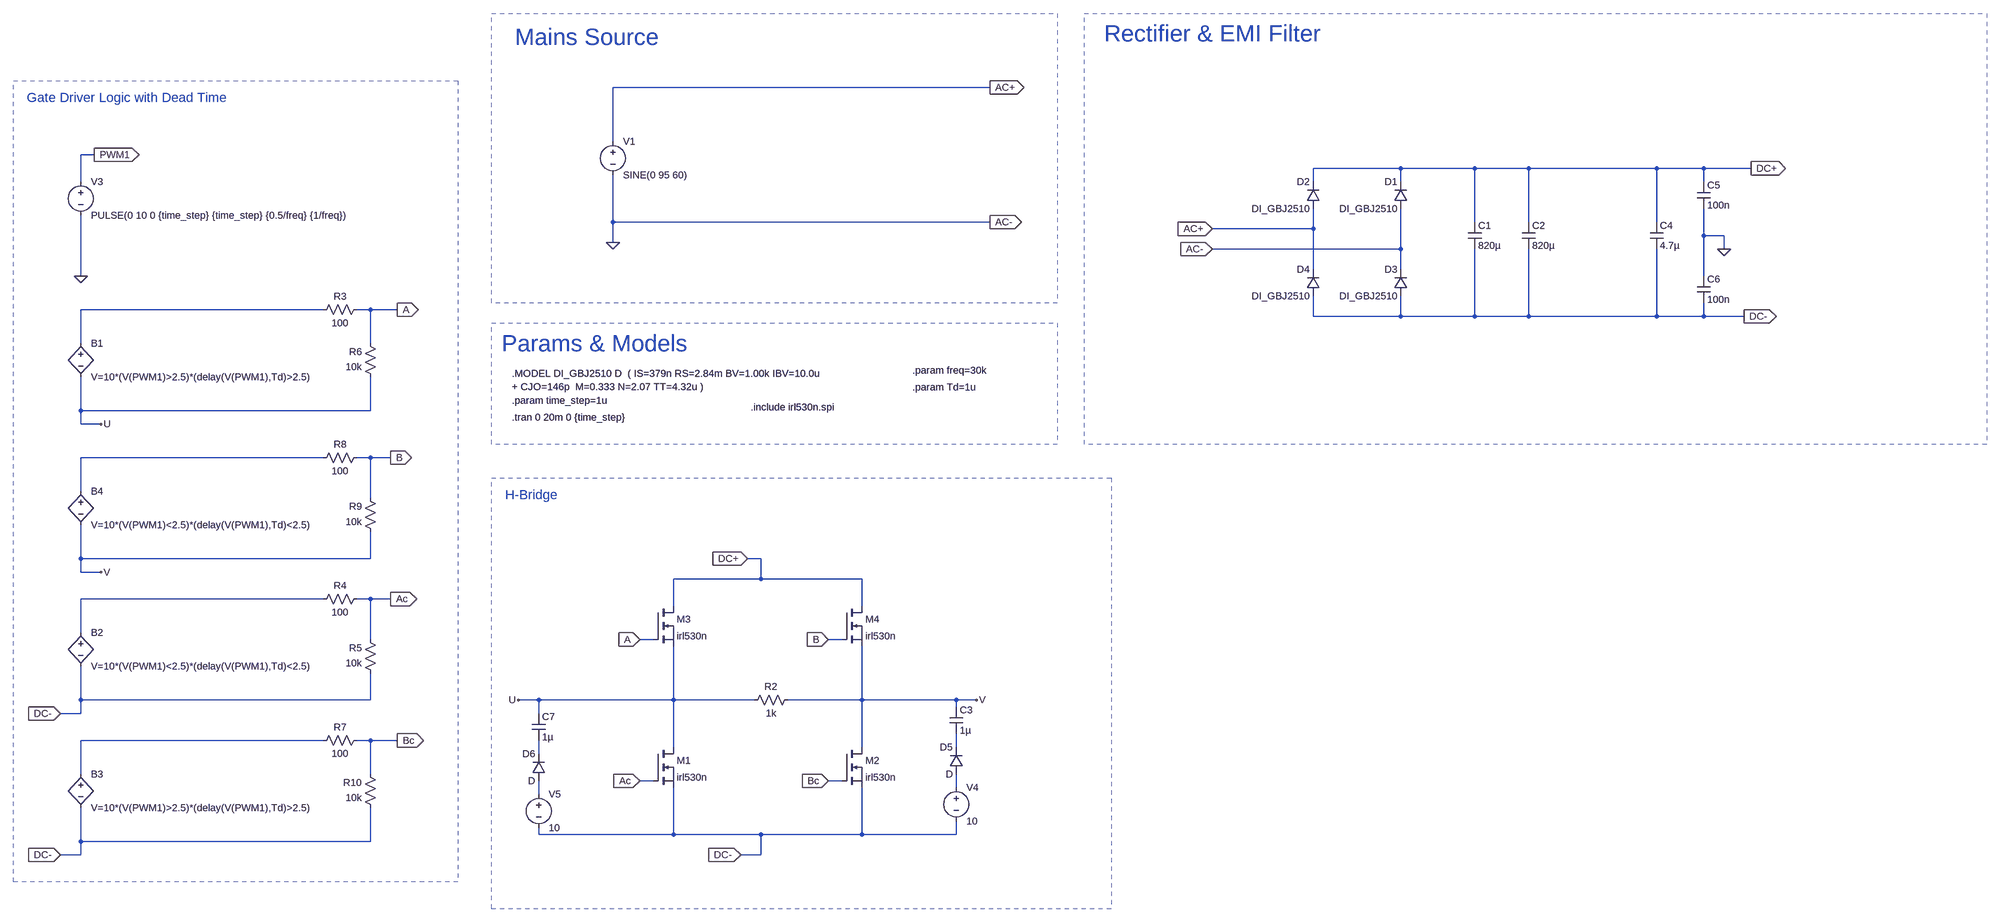
[diagram p0: schematic Rectifier_HBridge.asc]
Rectifier_HBridge.asc, the LTspice schematic file:
Version 4.1
SHEET 1 3640 1044
WIRE 512 -912 -384 -912
WIRE -384 -784 -384 -912
WIRE -1616 -752 -1648 -752
WIRE 1488 -720 1280 -720
WIRE 1664 -720 1488 -720
WIRE 1792 -720 1664 -720
WIRE 2096 -720 1792 -720
WIRE 2208 -720 2096 -720
WIRE 2320 -720 2208 -720
WIRE -1648 -688 -1648 -752
WIRE 1280 -688 1280 -720
WIRE 1488 -688 1488 -720
WIRE 2208 -688 2208 -720
WIRE -384 -592 -384 -704
WIRE 512 -592 -384 -592
WIRE 1664 -592 1664 -720
WIRE 1792 -592 1792 -720
WIRE 2096 -592 2096 -720
WIRE 1280 -576 1280 -624
WIRE 1280 -576 1040 -576
WIRE 2208 -560 2208 -624
WIRE 2256 -560 2208 -560
WIRE -384 -544 -384 -592
WIRE 1488 -528 1488 -624
WIRE 1488 -528 1040 -528
WIRE 2256 -528 2256 -560
WIRE 1280 -480 1280 -576
WIRE 1488 -480 1488 -528
WIRE -1648 -464 -1648 -608
WIRE 2208 -464 2208 -560
WIRE -1072 -384 -1648 -384
WIRE -960 -384 -992 -384
WIRE -896 -384 -960 -384
WIRE 1280 -368 1280 -416
WIRE 1488 -368 1488 -416
WIRE 1488 -368 1280 -368
WIRE 1664 -368 1664 -528
WIRE 1664 -368 1488 -368
WIRE 1792 -368 1792 -528
WIRE 1792 -368 1664 -368
WIRE 2096 -368 2096 -528
WIRE 2096 -368 1792 -368
WIRE 2208 -368 2208 -400
WIRE 2208 -368 2096 -368
WIRE 2304 -368 2208 -368
WIRE -1648 -304 -1648 -384
WIRE -960 -304 -960 -384
WIRE -1648 -144 -1648 -224
WIRE -960 -144 -960 -224
WIRE -960 -144 -1648 -144
WIRE -1648 -112 -1648 -144
WIRE -1600 -112 -1648 -112
WIRE -1072 -32 -1648 -32
WIRE -960 -32 -992 -32
WIRE -912 -32 -960 -32
WIRE -1648 48 -1648 -32
WIRE -960 64 -960 -32
WIRE -1648 208 -1648 128
WIRE -960 208 -960 144
WIRE -960 208 -1648 208
WIRE -32 208 -64 208
WIRE -1648 240 -1648 208
WIRE -1600 240 -1648 240
WIRE -32 256 -32 208
WIRE -32 256 -240 256
WIRE 208 256 -32 256
WIRE -1072 304 -1648 304
WIRE -960 304 -992 304
WIRE -912 304 -960 304
WIRE -240 320 -240 256
WIRE 208 320 208 256
WIRE -1648 384 -1648 304
WIRE -960 400 -960 304
WIRE -288 400 -320 400
WIRE 160 400 128 400
WIRE -1648 544 -1648 464
WIRE -960 544 -960 480
WIRE -960 544 -1648 544
WIRE -560 544 -608 544
WIRE -240 544 -240 416
WIRE -240 544 -560 544
WIRE -48 544 -240 544
WIRE 208 544 208 416
WIRE 208 544 32 544
WIRE 432 544 208 544
WIRE 480 544 432 544
WIRE 432 560 432 544
WIRE -1648 576 -1648 544
WIRE -1648 576 -1696 576
WIRE -560 576 -560 544
WIRE -1072 640 -1648 640
WIRE -960 640 -992 640
WIRE -896 640 -960 640
WIRE -240 656 -240 544
WIRE 208 656 208 544
WIRE 432 656 432 624
WIRE -560 672 -560 640
WIRE -1648 720 -1648 640
WIRE -960 720 -960 640
WIRE -288 736 -320 736
WIRE 160 736 128 736
WIRE 432 752 432 720
WIRE -560 768 -560 736
WIRE -560 864 -560 848
WIRE -240 864 -240 752
WIRE -240 864 -560 864
WIRE -32 864 -240 864
WIRE 208 864 208 752
WIRE 208 864 -32 864
WIRE 432 864 432 832
WIRE 432 864 208 864
WIRE -1648 880 -1648 800
WIRE -960 880 -960 800
WIRE -960 880 -1648 880
WIRE -1648 912 -1648 880
WIRE -1648 912 -1696 912
WIRE -32 912 -32 864
WIRE -32 912 -80 912
FLAG 1040 -576 AC+
IOPIN 1040 -576 In
FLAG 1040 -528 AC-
IOPIN 1040 -528 In
FLAG 512 -912 AC+
IOPIN 512 -912 Out
FLAG 512 -592 AC-
IOPIN 512 -592 Out
FLAG -384 -544 0
FLAG 2256 -528 0
FLAG -320 400 A
IOPIN -320 400 In
FLAG -320 736 Ac
IOPIN -320 736 In
FLAG 128 400 B
IOPIN 128 400 In
FLAG 128 736 Bc
IOPIN 128 736 In
FLAG -1648 -464 0
FLAG -1616 -752 PWM1
IOPIN -1616 -752 Out
FLAG -896 -384 A
IOPIN -896 -384 Out
FLAG -912 304 Ac
IOPIN -912 304 Out
FLAG -896 640 Bc
IOPIN -896 640 Out
FLAG -912 -32 B
IOPIN -912 -32 Out
FLAG -608 544 U
FLAG 480 544 V
FLAG -1600 -112 U
FLAG -1600 240 V
FLAG 2320 -720 DC+
IOPIN 2320 -720 Out
FLAG 2304 -368 DC-
IOPIN 2304 -368 Out
FLAG -64 208 DC+
IOPIN -64 208 In
FLAG -80 912 DC-
IOPIN -80 912 In
FLAG -1696 912 DC-
IOPIN -1696 912 In
FLAG -1696 576 DC-
IOPIN -1696 576 In
SYMBOL voltage -384 -800 R0
WINDOW 123 0 0 Left 0
WINDOW 39 0 0 Left 0
SYMATTR InstName V1
SYMATTR Value SINE(0 95 60)
SYMBOL cap 1648 -592 R0
SYMATTR InstName C1
SYMATTR Value 820µ
SYMBOL cap 1776 -592 R0
SYMATTR InstName C2
SYMATTR Value 820µ
SYMBOL cap 2080 -592 R0
SYMATTR InstName C4
SYMATTR Value 4.7µ
SYMBOL cap 2192 -688 R0
SYMATTR InstName C5
SYMATTR Value 100n
SYMBOL cap 2192 -464 R0
SYMATTR InstName C6
SYMATTR Value 100n
SYMBOL diode 1504 -624 R180
WINDOW 0 24 64 Left 2
WINDOW 3 24 0 Left 2
SYMATTR InstName D1
SYMATTR Value DI_GBJ2510
SYMBOL diode 1296 -624 R180
WINDOW 0 24 64 Left 2
WINDOW 3 24 0 Left 2
SYMATTR InstName D2
SYMATTR Value DI_GBJ2510
SYMBOL diode 1504 -416 R180
WINDOW 0 24 64 Left 2
WINDOW 3 24 0 Left 2
SYMATTR InstName D3
SYMATTR Value DI_GBJ2510
SYMBOL diode 1296 -416 R180
WINDOW 0 24 64 Left 2
WINDOW 3 24 0 Left 2
SYMATTR InstName D4
SYMATTR Value DI_GBJ2510
SYMBOL nmos -288 656 R0
SYMATTR InstName M1
SYMATTR Value irl530n
SYMATTR Prefix X
SYMBOL res 48 528 R90
WINDOW 0 0 56 VBottom 2
WINDOW 3 32 56 VTop 2
SYMATTR InstName R2
SYMATTR Value 1k
SYMBOL nmos 160 656 R0
SYMATTR InstName M2
SYMATTR Value irl530n
SYMATTR Prefix X
SYMBOL nmos -288 320 R0
SYMATTR InstName M3
SYMATTR Value irl530n
SYMATTR Prefix X
SYMBOL nmos 160 320 R0
SYMATTR InstName M4
SYMATTR Value irl530n
SYMATTR Prefix X
SYMBOL voltage -1648 -704 R0
WINDOW 123 0 0 Left 0
WINDOW 39 0 0 Left 0
SYMATTR InstName V3
SYMATTR Value PULSE(0 10 0 {time_step} {time_step} {0.5/freq} {1/freq})
SYMBOL bv -1648 -320 R0
SYMATTR InstName B1
SYMATTR Value V=10*(V(PWM1)>2.5)*(delay(V(PWM1),Td)>2.5)
SYMBOL bv -1648 368 R0
SYMATTR InstName B2
SYMATTR Value V=10*(V(PWM1)<2.5)*(delay(V(PWM1),Td)<2.5)
SYMBOL res -976 -400 R90
WINDOW 0 0 56 VBottom 2
WINDOW 3 32 56 VTop 2
SYMATTR InstName R3
SYMATTR Value 100
SYMBOL res -976 288 R90
WINDOW 0 0 56 VBottom 2
WINDOW 3 32 56 VTop 2
SYMATTR InstName R4
SYMATTR Value 100
SYMBOL res -944 496 R180
WINDOW 0 36 76 Left 2
WINDOW 3 36 40 Left 2
SYMATTR InstName R5
SYMATTR Value 10k
SYMBOL res -944 -208 R180
WINDOW 0 36 76 Left 2
WINDOW 3 36 40 Left 2
SYMATTR InstName R6
SYMATTR Value 10k
SYMBOL cap 416 560 R0
SYMATTR InstName C3
SYMATTR Value 1µ
SYMBOL voltage 432 736 R0
WINDOW 123 0 0 Left 0
WINDOW 39 0 0 Left 0
SYMATTR InstName V4
SYMATTR Value 10
SYMBOL diode 448 720 R180
WINDOW 0 24 64 Left 2
WINDOW 3 24 0 Left 2
SYMATTR InstName D5
SYMBOL cap -576 576 R0
SYMATTR InstName C7
SYMATTR Value 1µ
SYMBOL voltage -560 752 R0
WINDOW 123 0 0 Left 0
WINDOW 39 0 0 Left 0
SYMATTR InstName V5
SYMATTR Value 10
SYMBOL diode -544 736 R180
WINDOW 0 24 64 Left 2
WINDOW 3 24 0 Left 2
SYMATTR InstName D6
SYMBOL bv -1648 704 R0
SYMATTR InstName B3
SYMATTR Value V=10*(V(PWM1)>2.5)*(delay(V(PWM1),Td)>2.5)
SYMBOL bv -1648 32 R0
SYMATTR InstName B4
SYMATTR Value V=10*(V(PWM1)<2.5)*(delay(V(PWM1),Td)<2.5)
SYMBOL res -976 624 R90
WINDOW 0 0 56 VBottom 2
WINDOW 3 32 56 VTop 2
SYMATTR InstName R7
SYMATTR Value 100
SYMBOL res -976 -48 R90
WINDOW 0 0 56 VBottom 2
WINDOW 3 32 56 VTop 2
SYMATTR InstName R8
SYMATTR Value 100
SYMBOL res -944 160 R180
WINDOW 0 36 76 Left 2
WINDOW 3 36 40 Left 2
SYMATTR InstName R9
SYMATTR Value 10k
SYMBOL res -944 816 R180
WINDOW 0 36 76 Left 2
WINDOW 3 36 40 Left 2
SYMATTR InstName R10
SYMATTR Value 10k
TEXT -624 -232 Left 2 !.MODEL DI_GBJ2510 D  ( IS=379n RS=2.84m BV=1.00k IBV=10.0u\n+ CJO=146p  M=0.333 N=2.07 TT=4.32u )
TEXT 784 -1040 Left 5 ;Rectifier & EMI Filter
TEXT -616 -1032 Left 5 ;Mains Source
TEXT -624 -128 Left 2 !.tran 0 20m 0 {time_step}
TEXT -624 -168 Left 2 !.param time_step=1u
TEXT -648 -304 Left 5 ;Params & Models
TEXT -56 -152 Left 2 !.include irl530n.spi
TEXT -1776 -888 Left 3 ;Gate Driver Logic with Dead Time
TEXT -640 56 Left 3 ;H-Bridge
TEXT 328 -240 Left 2 !.param freq=30k
TEXT 328 -200 Left 2 !.param Td=1u
RECTANGLE Normal 672 -400 -672 -1088 1
RECTANGLE Normal 672 -64 -672 -352 1
RECTANGLE Normal 2880 -64 736 -1088 1
RECTANGLE Normal -752 976 -1808 -928 1
RECTANGLE Normal 800 1040 -672 16 1

The netlist it stands for:
* Rectifier_HBridge.asc
V1 AC+ 0 SINE(0 95 60)
C1 DC+ DC- 820µ
C2 DC+ DC- 820µ
C4 DC+ DC- 4.7µ
C5 DC+ 0 100n
C6 0 DC- 100n
D1 0 DC+ DI_GBJ2510
D2 AC+ DC+ DI_GBJ2510
D3 DC- 0 DI_GBJ2510
D4 DC- AC+ DI_GBJ2510
X§M1 U Ac DC- irl530n  ; pins D G S
R2 V U 1k
X§M2 V Bc DC- irl530n  ; pins D G S
X§M3 DC+ A U irl530n  ; pins D G S
X§M4 DC+ B V irl530n  ; pins D G S
V3 PWM1 0 PULSE(0 10 0 {time_step} {time_step} {0.5/freq} {1/freq})
B1 N001 U V=10*(V(PWM1)>2.5)*(delay(V(PWM1),Td)>2.5)
B2 N003 DC- V=10*(V(PWM1)<2.5)*(delay(V(PWM1),Td)<2.5)
R3 A N001 100
R4 Ac N003 100
R5 DC- Ac 10k
R6 U A 10k
C3 V N005 1µ
V4 N007 DC- 10
D5 N007 N005 D
C7 U N006 1µ
V5 N008 DC- 10
D6 N008 N006 D
B3 N004 DC- V=10*(V(PWM1)>2.5)*(delay(V(PWM1),Td)>2.5)
B4 N002 V V=10*(V(PWM1)<2.5)*(delay(V(PWM1),Td)<2.5)
R7 Bc N004 100
R8 B N002 100
R9 V B 10k
R10 DC- Bc 10k
.model D D
.lib standard.dio
.MODEL DI_GBJ2510 D  ( IS=379n RS=2.84m BV=1.00k IBV=10.0u
+ CJO=146p  M=0.333 N=2.07 TT=4.32u )
* Rectifier & EMI Filter
* Mains Source
.tran 0 20m 0 {time_step}
.param time_step=1u
* Params & Models
.include irl530n.spi
* Gate Driver Logic with Dead Time
* H-Bridge
.param freq=30k
.param Td=1u
.backanno
.end